# Altium schematic sheet current-source.SchDoc
size A4; SheetNumber: 1; SheetTotal: 1
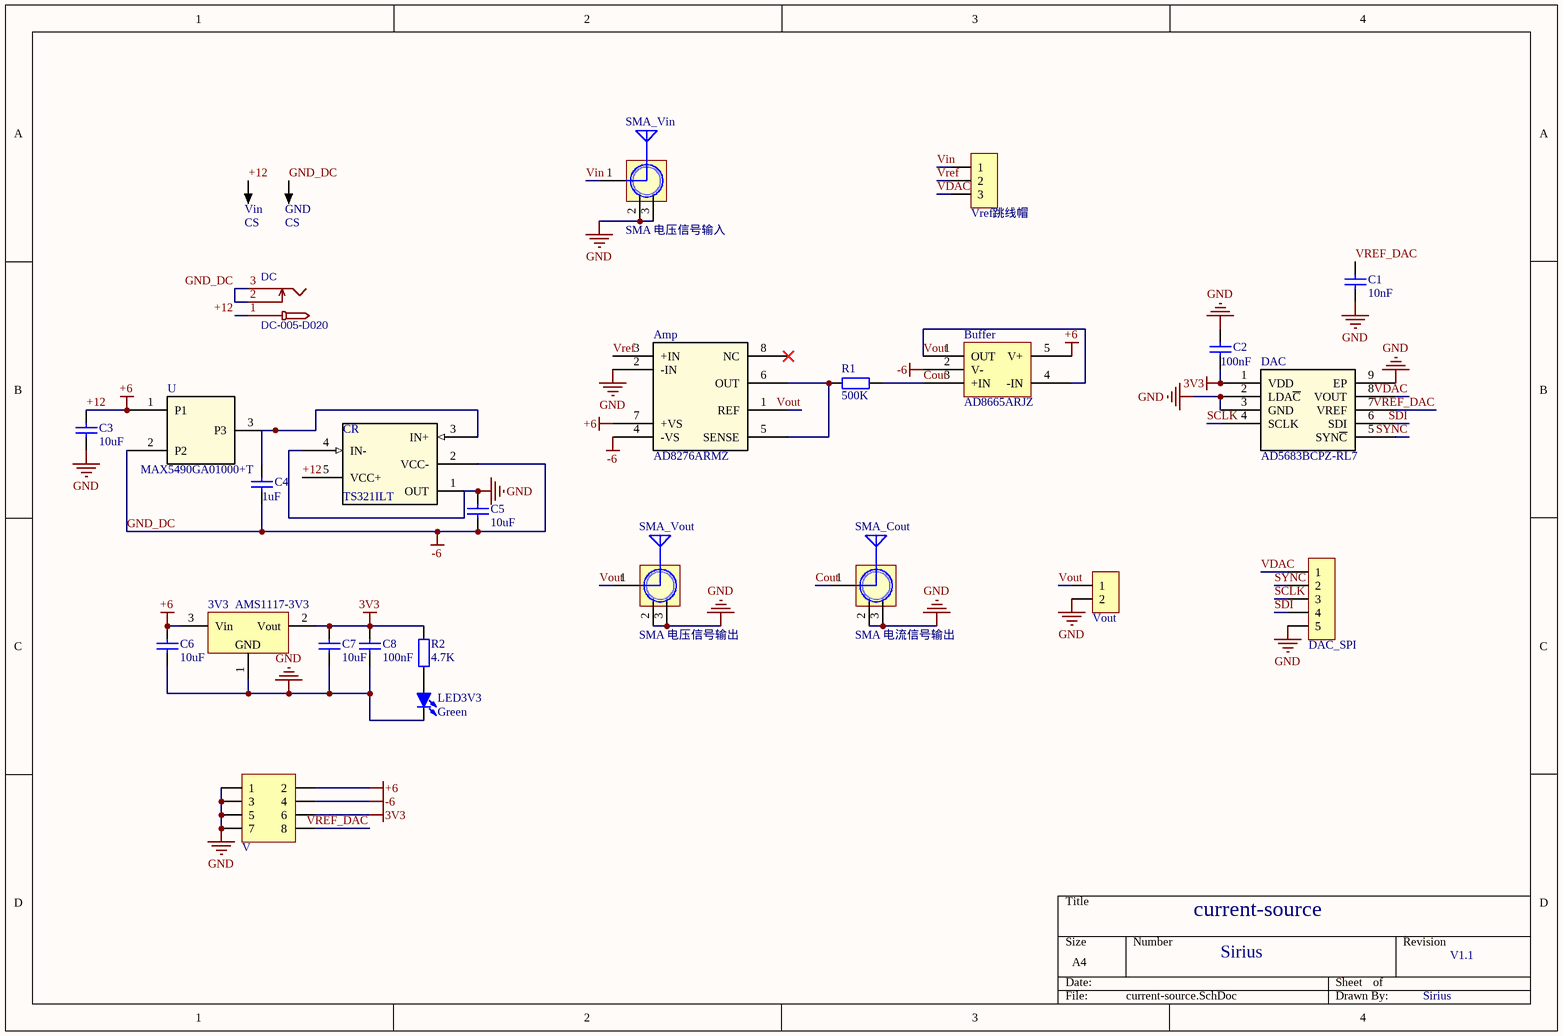
[diagram p0: current-source.SchDoc]

## Parts
3V3  AMS1117-3V3  [SOT89_L]
Amp  AD8276ARMZ  [RM_8_ADI-L]
Buffer  AD8665ARJZ  [UJ_5_ADI-L]
C1  10nF  [C0603_L]
C2  100nF  [C0603_L]
C3  10uF  [C0603_L]
C4  1uF  [C0603_L]
C5  10uF  [C0603_L]
C6  10uF  [C0603_L]
C7  10uF  [C0603_L]
C8  100nF  [C0603_L]
CR  TS321ILT  [SOT23-5_STM-L]
DAC  AD5683BCPZ-RL7  [CP_8_10_ADI-L]
DAC_SPI  HDR-1X5  [XH2.54-WI-5P]  (value not drawn)
DC  DC-005-D020  [DC-IN-TH_G-SWITCH_DC-005-D020]
GND  CS  [R100]
LED3V3  Green  [LED0603_G]
R1  500K  [R0603_L]
R2  4.7K  [R0603_L]
SMA_Cout  SMA 电流信号输出  [SMA_FR]
SMA_Vin  SMA 电压信号输入  [SMA_FR]
SMA_Vout  SMA 电压信号输出  [SMA_FR]
U  MAX5490GA01000+T  [21-0051H_MXM-L]
V  Header 4X2  [HDR2.54-LI-2x4P]  (value not drawn)
Vin  CS  [R100]
Vout  HDR-1X2  [HDR2.54-LI-2P]  (value not drawn)
Vref跳线帽  HDR-1X3  [HDR2.54-LI-3P]  (value not drawn)

## Nets
3V3: 3V3.2(Vout) C2.1 C7.2 C8.2 DAC.1(VDD) R2.2 V.6
+12: 3V3.3(Vin) Amp.7(+VS) Buffer.5(V+) C3.1 C6.2 CR.5(VCC+) DC.1 U.1(P1) V.2 Vin.1  [also labelled +6]
GND: 3V3.1(GND) Amp.2(-IN) C1.1 C2.2 C3.2 C5.1 C6.1 C7.1 C8.1 CR.1(OUT) CR.4(IN-) DAC.2(LDA~{C}) DAC.3(GND) DAC.9(EP) DAC_SPI.5 LED3V3.2(K) SMA_Cout.2(GND) SMA_Cout.3(GND) SMA_Vin.2(GND) SMA_Vin.3(GND) SMA_Vout.2(GND) SMA_Vout.3(GND) V.1 V.3 V.5 V.7 Vout.2
GND_DC: Amp.4(-VS) Buffer.2(V-) C4.1 C5.2 CR.2(VCC-) DC.2 DC.3 GND.1 U.2(P2) V.4  [also labelled -6]
Cout: Buffer.3(+IN) R1.1 SMA_Cout.1(ANT)
SCLK: DAC.4(SCLK) DAC_SPI.3
SDI: DAC.6(SDI) DAC_SPI.4
SYNC: DAC.5(SYN~{C}) DAC_SPI.2
VDAC: DAC.8(VOUT) DAC_SPI.1 Vref跳线帽.3
Vin: SMA_Vin.1(ANT) Vref跳线帽.1
Vout: Amp.1(REF) Buffer.1(OUT) Buffer.4(-IN) SMA_Vout.1(ANT) Vout.1
Vref: Amp.3(+IN) Vref跳线帽.2
VREF_DAC: C1.2 DAC.7(VREF) V.8
NetAmp_5: Amp.5(SENSE) Amp.6(OUT) R1.2
NetC4_2: C4.2 CR.3(IN+) U.3(P3)
NetLED3V3_1: LED3V3.1(A) R2.1

Not connected (* = marked no-connect by the designer): Amp 8(NC)*

## Notes on the sheet
- current-source
- Sirius
- V1.1

## Library data of the parts
3V3 = AMS1117_SOT89: 三端稳压芯片; BOM名称: 稳压芯片; 封装库来自淘宝卖家 ID：黄晶宝石: 其他店铺购入均为盗版，请立即申请退款，本店现金奖励5~20元; 联系卖家 免费查找封装: 唯一出售店铺网址https://shop463601444.taobao.com
Amp = AD8276: 差动放大器; Mfr_Name: Analog Devices Inc; Manufacturer_Part_Number: AD8276ARZ; Copyright: Copyright (C) 2022 Ultra Librarian. All rights reserved.; RefDes: RefDes; Type: DEV
Buffer = AD8665ARJZ: 低偏置电流运放
C1-C8 = C: 贴片电容; BOM名称: 无极性贴片电容; 联系卖家，免费查找封装: 唯一出售店铺网址https://shop463601444.taobao.com
CR = TS321ILT: Amp; Mfr_Name: STMicroelectronics; Copyright: Copyright (C) 2022 Ultra Librarian. All rights reserved.; Manufacturer_Part_Number: TS321ILT; RefDes: RefDes; Type: DEV
DAC = AD5683BCPZ-RL7: 16bit DAC; Mfr_Name: Analog Devices Inc; Copyright: Copyright (C) 2022 Ultra Librarian. All rights reserved.; Manufacturer_Part_Number: AD5683BCPZ-RL7; RefDes: RefDes; Type: DEV
DAC_SPI = Header 5: 5P接插件; 封装库来自淘宝卖家 ID：黄晶宝石: 其他店铺购入均为盗版假冒封装库; 联系卖家，免费查找封装: 唯一出售店铺网址https://shop463601444.taobao.com; BOM名称: 5P接插件
DC = DC-005-D020: BOM_Manufacturer: G-Switch(品赞); Contributor: LCSC; BOM_Supplier: LCSC; BOM_Supplier Part: C963210; BOM_Manufacturer Part: DC-005-D020; link: https://atta.szlcsc.com//upload/public/pdf/source/20210114/C963210_BA756E532545D702193AC55944B492EE.pdf; spicePre: D; spiceSymbolName: DC-005-D020
GND Vin = CS: 探针焊盘; 联系卖家，免费查找封装: 唯一出售店铺网址https://shop463601444.taobao.com; 封装库来自淘宝卖家ID：黄晶宝石: 其他店铺购入均为盗版假冒封装库，请立即申请退款; BOM名称: 探针焊盘
LED3V3 = LED-SMD: 贴片LED; 联系卖家 免费查找封装: 封装库来自淘宝卖家ID：黄晶宝石; BOM名称: 贴片LED
R1 R2 = R: 贴片电阻; 联系卖家，免费查找封装: 唯一出售店铺网址https://shop463601444.taobao.com; BOM名称: 贴片电阻
SMA_Cout SMA_Vin SMA_Vout = SMA: SMA-2.4G射频天线接口; 联系卖家，免费技术支持: 唯一出售店铺网址https://shop463601444.taobao.com; BOM名称: SMA-2.4G射频天线接口
U = MAX5490GA01000+T: 分压器; Mfr_Name: Maxim Integrated Products; Copyright: Copyright (C) 2022 Ultra Librarian. All rights reserved.; Manufacturer_Part_Number: MAX5490GA01000+T; RefDes: RefDes; Type: DEV
V = Header 4X2: 4*2P接插件; 封装库来自淘宝卖家 ID：黄晶宝石: 其他店铺购入均为盗版假冒封装库; 联系卖家，免费查找封装: 唯一出售店铺网址https://shop463601444.taobao.com; BOM名称: 4*2P接插件
Vout = Header 2: 2P接插件; 封装库来自淘宝卖家 ID：黄晶宝石: 其他店铺购入均为盗版假冒封装库; 联系卖家，免费查找封装: 唯一出售店铺网址https://shop463601444.taobao.com; BOM名称: 2P接插件
Vref跳线帽 = Header 3: 3P接插件; 封装库来自淘宝卖家 ID：黄晶宝石: 其他店铺购入均为盗版假冒封装库; 联系卖家，免费查找封装: 唯一出售店铺网址https://shop463601444.taobao.com; BOM名称: 3P接插件